# Altium schematic sheet Mojo.SchDoc
size B; Engineer: JChiu; Organization: ToyBuilder Labs; Address1: 1100 S Garfield Avenue; Address2: Alhambra, CA 91801; Address4: +1 (626) 808-4010; DocumentNumber: 2; SheetNumber: 2; SheetTotal: 3
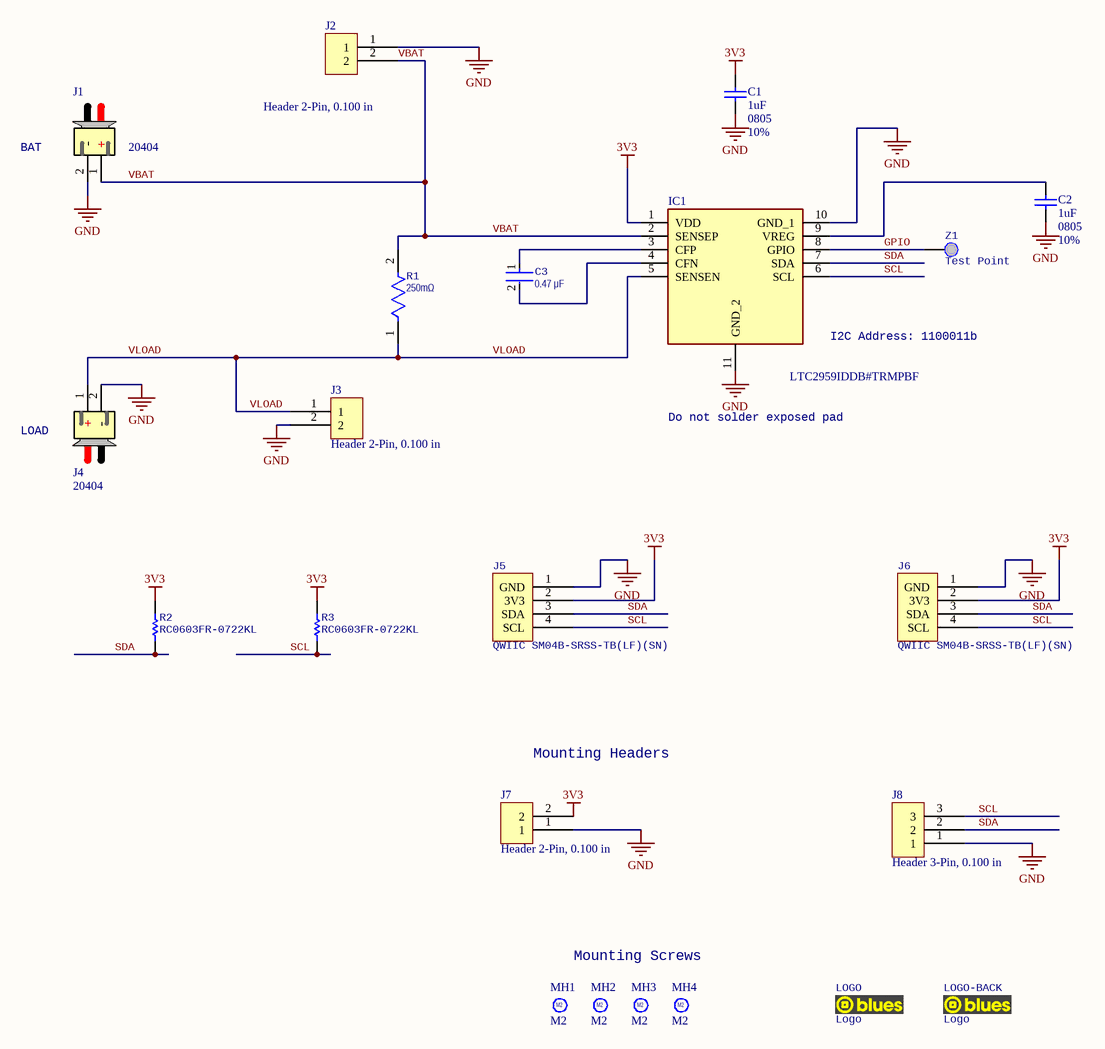
[diagram p0: Mojo.SchDoc]

## Parts
C1  Capacitance: 1uF  Case/Package: 0805  Tolerance: 10%  [CAPC2013X70X45NL10T25]  (hidden comment: GRM216R61E105KA12D)
C2  Capacitance: 1uF  Case/Package: 0805  Tolerance: 10%  [CAPC2013X70X45NL10T25]  (hidden comment: GRM216R61E105KA12D)
C3  value 0.47 μF  [FP-C0805C-DN-MFG]  (hidden comment: C0805C474K5RACTU)
IC1  LTC2959IDDB#TRMPBF  [SON50P200X300X80-11N-D]
J1  20404  [BAT-AF-S2B-PH-SM4]
J2  Header 2-Pin, 0.100 in  [HEADER_AA_002]
J3  Header 2-Pin, 0.100 in  [HEADER_AA_002]
J4  20404  [BAT-AF-S2B-PH-SM4]
J5  QWIIC SM04B-SRSS-TB(LF)(SN)  [QWIIC_SM04B-SRSS]
J6  QWIIC SM04B-SRSS-TB(LF)(SN)  [QWIIC_SM04B-SRSS]
J7  Header 2-Pin, 0.100 in  [HEADER_AA_002]
J8  Header 3-Pin, 0.100 in  [HEADER_AA_003]
LOGO  Logo  [LOGO_BLUES_WIRELESS_v2]  (graphical)
LOGO-BACK  Logo  [LOGO_BLUES_WIRELESS_v2]  (graphical)
MH1  M2  [HOLE_2MM]  (no BOM)
MH2  M2  [HOLE_2MM]  (no BOM)
MH3  M2  [HOLE_2MM]  (no BOM)
MH4  M2  [HOLE_2MM]  (no BOM)
R1  Resistance: 250mΩ  [FP-WSL2010-0_508-MFG]  (hidden comment: WSL2010R2500FEA)
R2  RC0603FR-0722KL  [RESC1608X55X25LL10T15]
R3  RC0603FR-0722KL  [RESC1608X55X25LL10T15]
Z1  Test Point  [testp_40pad]  (no BOM)

## Nets
3V3: C1.2 IC1.1(VDD) J5.2(3V3) J6.2(3V3) J7.2 R2.2 R3.2
GND: C1.1 C2.1 IC1.10(GND_1) IC1.11(GND_2) J1.2(-) J2.1 J3.2 J4.2(-) J5.1(GND) J6.1(GND) J7.1 J8.1
GPIO: IC1.8(GPIO) Z1.1
SCL: IC1.6(SCL) J5.4(SCL) J6.4(SCL) J8.3 R3.1
SDA: IC1.7(SDA) J5.3(SDA) J6.3(SDA) J8.2 R2.1
VBAT: IC1.2(SENSEP) J1.1(+) J2.2 R1.2
VLOAD: IC1.5(SENSEN) J3.1 J4.1(+) R1.1
NetC2_2: C2.2 IC1.9(VREG)
NetC3_1: C3.1 IC1.3(CFP)
NetC3_2: C3.2 IC1.4(CFN)

## Notes on the sheet
- (near J1) BAT
- (near IC1) I2C Address: 1100011b
- (near J4) LOAD
- Do not solder exposed pad
- Mounting Headers
- Mounting Screws
- Title
- Size:
- Date:
- B
- Number:
- Time:
- Revision:
- Sheet
- of
- File:

## Library data of the parts
C1 C2 = CMP-2007-00957-1: Manufacturer: Murata; Dielectric: X5R; Voltage: 25V; Part Number: GRM216R61E105KA12D; Manufacturer Part Number: GRM216R61E105KA12D; Supplier 1: Digi-Key; Supplier Part Number 1: 490-1700-1-ND
C3 = CMP-2007-03659-2: CAP CER 0.47UF 50V 10% X7R 0805; Manufacturer: KEMET; Temperature Coefficient: 30ppm/°C; Tolerance: 0.1; Material: Ceramic; Capacitance: 0.47 μF; ComponentLink2Description: Datasheet; RoHS: TRUE; Digikey Description: CAP CER 0.47UF 50V 10% X7R 0805; Temperature: -55°C to +125°C; Temperature Range Low: -55°C; Temperature Range High: +125°C; Manufacturer Part Number: C0805C474K5RACTU; Temperature Characteristic: X7R; Height: 0.88mm; Octopart: https://octopart.com/c0805c474k5ractu-kemet-144543; Mouser Description: 0805 C 470nF Ceramic Multilayer Capacitor, 50 VDC, +125degC, X7R Dielec, +/-10%; Device Class L2: Capacitors; Voltage Rating: 50 V; ComponentLink2URL: https://content.kemet.com/datasheets/KEM_C1003_C0G_SMD.pdf; Package: C0805C-DN; Ipc Land Pattern Name: CAPC200125X78; Automotive: No; Device Class L1: Passive Components; Device Class L3: Ceramic Capacitors; Category: Cap; Lead Free: Yes
IC1 = LTC2959IDDB#TRMPBF: Ultra-low-power Battery Gas Gaug; Manufacturer_Name: Analog Devices; Datasheet Link: https://www.analog.com/LTC2959/datasheet; Height: 0.8mm; Manufacturer_Part_Number: LTC2959IDDB#TRMPBF; Mouser Part Number: 584-LTC2959IDDBTRMPB; Mouser Price/Stock: https://www.mouser.co.uk/ProductDetail/Analog-Devices/LTC2959IDDBTRMPBF?qs=pUKx8fyJudDXTmMT1kM1kQ%3D%3D; ComponentLink1Description: Datasheet; ComponentLink1URL: https://www.analog.com/media/en/technical-documentation/data-sheets/ltc2959.pdf; Supplier 1: Digikey; Supplier Part Number 1: 505-LTC2959IDDB#TRMPBFCT-ND; Manufacturer: Analog Devices; Manufacturer Part Number: LTC2959IDDB#TRMPBF; RoHS: No; Category: Battery Management; Stock 1: 2988; Pricing 1: 1=9.13, 10=8.252, 25=7.868, 100=6.8316, 250=6.5246 (USD)
J1 J4 = BAT-PH-ADAFRUIT-SMT-RA: Battery Connector PH-2POS wired for Adafruit style packs.  SMD RA 4UCON 20404 (similar to JST S2B-PH-SM4-TB(LF)(SN)); Cross 2: JST S2B-PH-SM4-TB(LF)(SN) (tight fit); Manufacturer: 4UCON; Manufacturer Part Number: 20404; ComponentLink1URL: http://www.farnell.com/datasheets/1699381.pdf; ComponentLink1Description: http://www.farnell.com/datasheets/1699381.pdf; Mounting Type: SMD; Cross 1: Adafruit 1769
J2 J3 J7 = HEADER_AA_2: Header 2-Pin, 0.100 inch (0.230 inch head); Manufacturer: Sullins; Manufacturer Part Number: PEC02SAAN; Number of Positions: 2; Function 1: Function 1; Function 2: Function 2; Mount: Through Hole; Number of Rows: 1
J5 J6 = QWIIC_SM04B-SRSS: CONN HEADER SH 4POS SIDE 1MM TIN QWIIC pinout; Manufacturer: JST; Number of Positions: 4; Connector Type: Male Pin; Contact Resistance: 40mR; Max Current Rating: 1A; Max Voltage Rating (AC): 50V; Pitch: 0.039inch; Supplier 1: Digi-Key; Manufacturer Part Number: SM04B-SRSS-TB(LF)(SN); RoHS: Yes; Category: Connectors; Pricing 1: 1=0.57000, 10=0.49300, 100=0.40630, 500=0.35328, 1000=0.29146 (USD); Mount: Surface Mount; Contact Material: Copper Alloy; Contact Plating: Tin,Copper; Color: Natural; Housing Color: Beige; Housing Material: Polyamide; Min Operating Temperature: -25°C; Max Operating Temperature: 85°C; Number of Rows: 1; Termination: Solder; Packaging: Tape and Reel; Orientation: Right Angle; Number of Contacts: 4; Max Voltage Rating (DC): 50V; Length: 6mm; Depth: 4.95mm; Lead Free: Lead Free; ComponentLink1URL: https://datasheet.ciiva.com/26894/getdatasheetpartid-640736-26894676.pdf?src-supplier=Verical; ComponentLink1Description: https://datasheet.ciiva.com/26894/getdatasheetpartid-640736-26894676.pdf?src-supplier=Verical; ComponentLink2URL: https://datasheet.ciiva.com/26894/getdatasheetpartid-499363-26894945.pdf?src-supplier=Verical; ComponentLink2Description: https://datasheet.ciiva.com/26894/getdatasheetpartid-499363-26894945.pdf?src-supplier=Verical; ComponentLink3URL: https://datasheet.ciiva.com/16487/jstsm04b-srss-tb-lf-sn-16487222.pdf?src-supplier=Future+Electronics; ComponentLink3Description: https://datasheet.ciiva.com/16487/jstsm04b-srss-tb-lf-sn-16487222.pdf?src-supplier=Future+Electronics; Supplier Part Number 1: 455-1804-1-ND
J8 = HEADER_AA_3: Header 3-Pin, 0.100 inch (0.230 inch head); Manufacturer: Sullins; Manufacturer Part Number: PEC03SAAN; Number of Positions: 3; Function 1: Function 1; Function 2: Function 2; Mount: Through Hole; Number of Rows: 1
LOGO LOGO-BACK = LOGO_BLUES_WIRELESS_V2: Logo, Blues Wireless
MH1-MH4 = Bare Hole M2: Bare Hole, M2
R1 = RES_2020_0R250: 0R250 Metal Strp 2010 1% 1/2W 75Ppm/ C WSL2010R2500FEA; Manufacturer: Vishay Dale; Temperature Coefficient: 75ppm/°C; Voltage Rating (DC): 150mV; Max Power Dissipation: 500mW; Height: 635µm; Military Standard: Not; Number of Terminations: 2; Case/Package: 2010; Composition: Metal Element; Lead Free: Lead Free; Contact Plating: Tin; Width: 2.54mm; Max Operating Temperature: 170°C; Packaging: Cut Tape; RoHS: Compliant; Schedule B: 8533210045, 8533210045; Voltage Rating (AC): 150mV; Mount: Surface Mount; Termination: SMD/SMT; Case Code (Imperial): 2010; Features: Moisture Resistant; Min Operating Temperature: -65°C; Power Rating: 500mW; Tolerance: 1%; Radiation Hardening: No; REACH SVHC: No SVHC; Weight: 38.895546mg; Voltage Rating: 150mV; Case Code (Metric): 5025; Length: 5.08mm; Depth: 2.54mm; Number of Pins: 2; Manufacturer Part Number: WSL2010R2500FEA
R2 R3 = CMP-1012-00659-3: Chip Resistor, 22 KOhm, +/- 1%, 0.1 W, -55 to 155 degC, 0603 (1608 Metric), RoHS, Tape and Reel; Tolerance: 10%; Current Rating: 290 mA; Shielding: Unshielded; Resistance: 2.9 Ohm; PackageReference: 0603; PackageDescription: 2-Pin Surface Mount Device, Body 1.6 x 0.8 mm; ComponentLink2URL: http://www.yageo.com/documents/recent/PYu-RC_Group_51_RoHS_L_04.pdf; RoHSCompliant: True; REACH SVHC: No SVHC; ComponentLink1Description: Manufacturer URL; ComponentLink2Description: Datasheet; DatasheetVersion: Rev. 4, 02/2016; Min Operating Temperature: -55degC; Pins: 2; Mount: Through Hole; Height: 11 mm; Packaging: Bulk; Radiation Hardening: No; Package Quantity: 100; Diameter: 8.5 mm; Lead Pitch: 5 mm; Case/Package: Radial; Max Operating Temperature: 105degC; ComponentLink1URL: http://www.yageo.com/
Z1 = test_pt